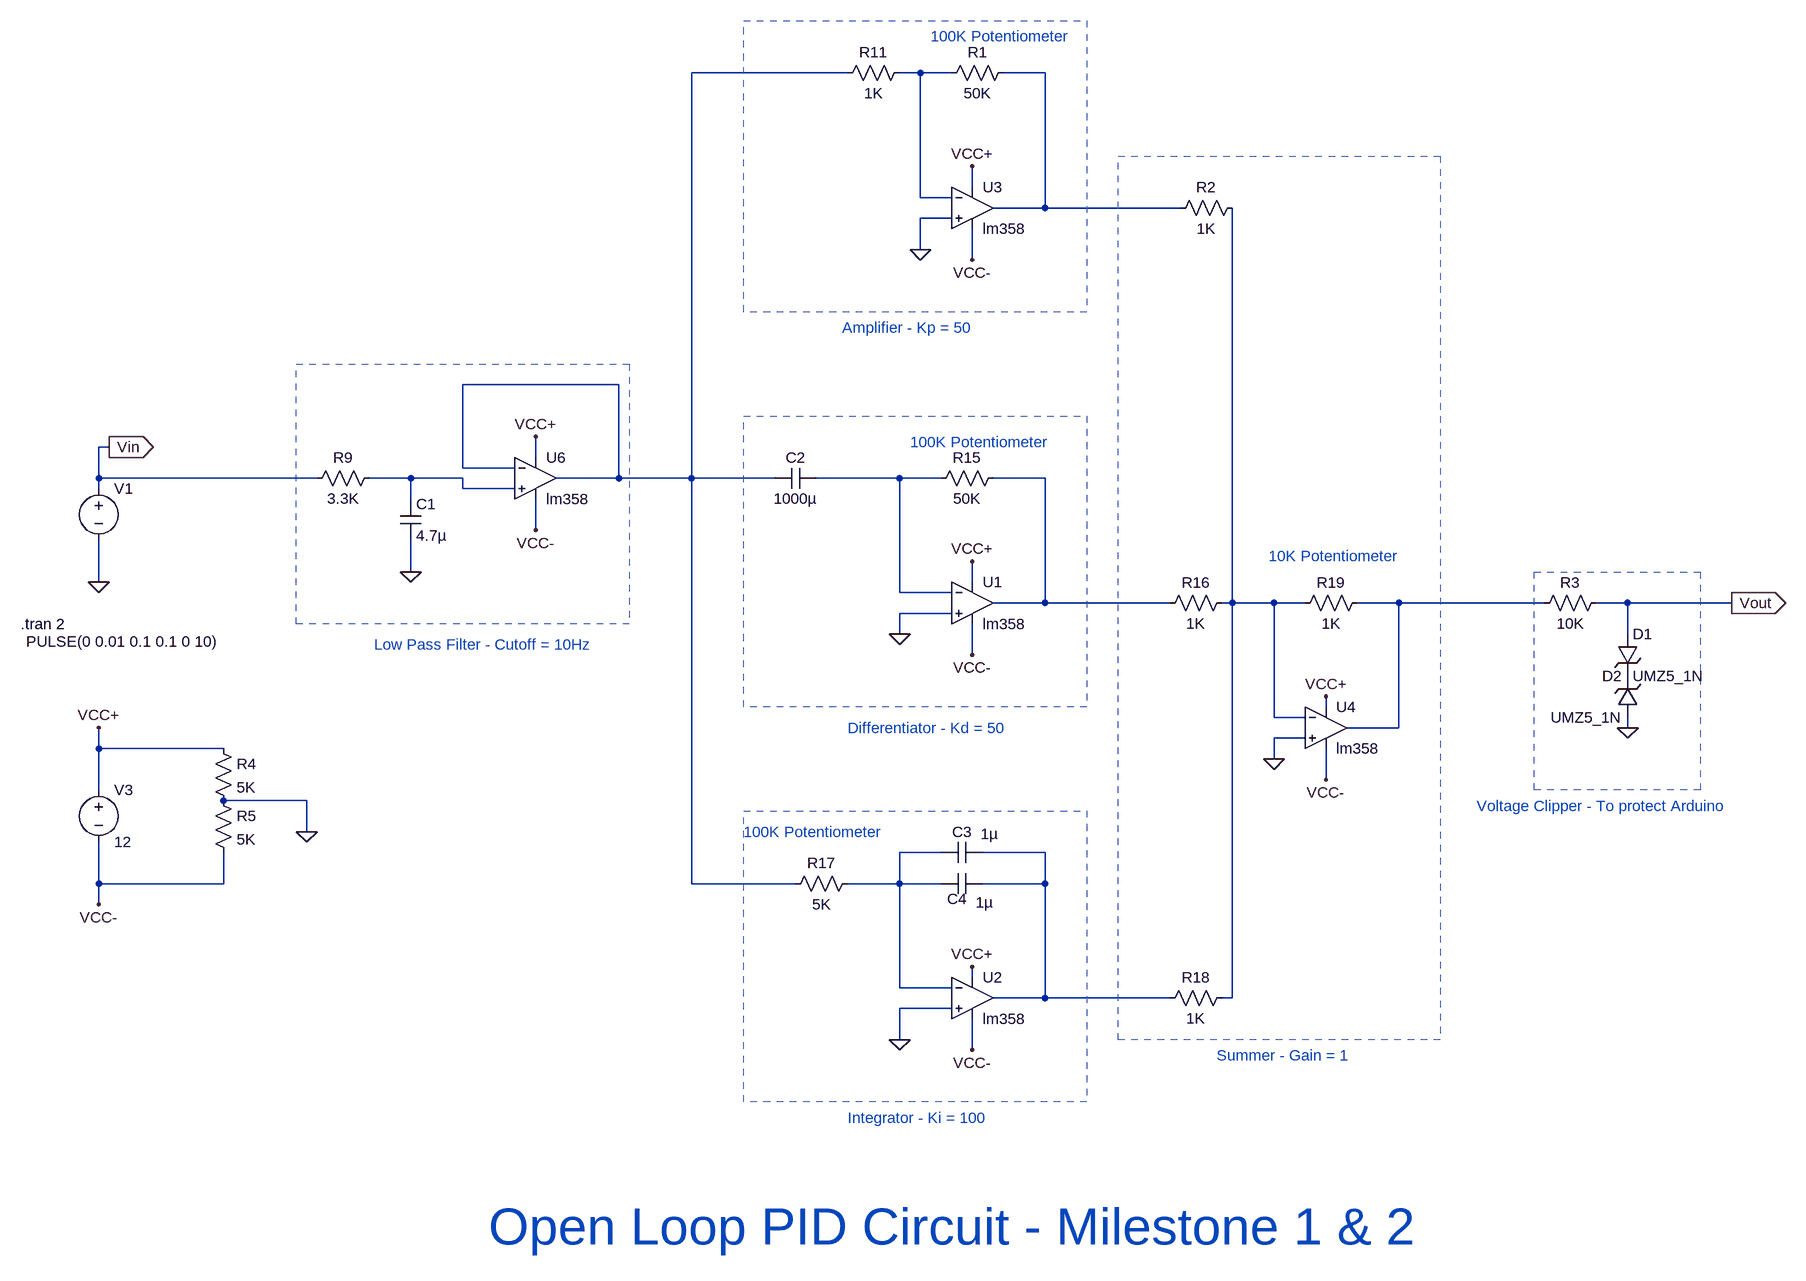
[diagram p0: schematic ElectronicsProject-PID-NoFeedback.asc]
ElectronicsProject-PID-NoFeedback.asc, the LTspice schematic file:
Version 4
SHEET 1 2816 1424
WIRE 1200 -400 960 -400
WIRE 1312 -400 1280 -400
WIRE 1360 -400 1312 -400
WIRE 1504 -400 1440 -400
WIRE 1392 -224 1392 -256
WIRE 1312 -208 1312 -400
WIRE 1360 -208 1312 -208
WIRE 1504 -192 1504 -400
WIRE 1504 -192 1424 -192
WIRE 1712 -192 1504 -192
WIRE 1360 -176 1312 -176
WIRE 1312 -128 1312 -176
WIRE 1392 -112 1392 -160
WIRE 848 80 608 80
WIRE 64 176 48 176
WIRE 720 192 720 160
WIRE 608 208 608 80
WIRE 688 208 608 208
WIRE 48 224 48 176
WIRE 384 224 48 224
WIRE 528 224 464 224
WIRE 608 224 528 224
WIRE 848 224 848 80
WIRE 848 224 752 224
WIRE 960 224 960 -400
WIRE 960 224 848 224
WIRE 1088 224 960 224
WIRE 1280 224 1152 224
WIRE 1344 224 1280 224
WIRE 1504 224 1424 224
WIRE 48 240 48 224
WIRE 608 240 608 224
WIRE 688 240 608 240
WIRE 528 256 528 224
WIRE 720 304 720 256
WIRE 528 368 528 320
WIRE 48 384 48 320
WIRE 1392 384 1392 352
WIRE 1280 400 1280 224
WIRE 1360 400 1280 400
WIRE 1504 416 1504 224
WIRE 1504 416 1424 416
WIRE 1696 416 1504 416
WIRE 1792 416 1792 -192
WIRE 1792 416 1776 416
WIRE 1856 416 1792 416
WIRE 1904 416 1856 416
WIRE 2048 416 1984 416
WIRE 2272 416 2048 416
WIRE 2400 416 2352 416
WIRE 2560 416 2400 416
WIRE 1360 432 1280 432
WIRE 1280 464 1280 432
WIRE 2400 464 2400 416
WIRE 1392 496 1392 448
WIRE 1936 576 1936 560
WIRE 1856 592 1856 416
WIRE 1904 592 1856 592
WIRE 2048 608 2048 416
WIRE 2048 608 1968 608
WIRE 2400 608 2400 592
WIRE 1904 624 1856 624
WIRE 48 640 48 608
WIRE 240 640 48 640
WIRE 1856 656 1856 624
WIRE 1936 688 1936 640
WIRE 48 704 48 640
WIRE 368 720 240 720
WIRE 368 768 368 720
WIRE 1344 800 1280 800
WIRE 1504 800 1408 800
WIRE 48 848 48 784
WIRE 240 848 240 800
WIRE 240 848 48 848
WIRE 960 848 960 224
WIRE 1120 848 960 848
WIRE 1280 848 1280 800
WIRE 1280 848 1200 848
WIRE 1344 848 1280 848
WIRE 1504 848 1504 800
WIRE 1504 848 1408 848
WIRE 48 880 48 848
WIRE 1392 992 1392 976
WIRE 1280 1008 1280 848
WIRE 1360 1008 1280 1008
WIRE 1504 1024 1504 848
WIRE 1504 1024 1424 1024
WIRE 1696 1024 1504 1024
WIRE 1792 1024 1792 416
WIRE 1792 1024 1776 1024
WIRE 1360 1040 1280 1040
WIRE 1280 1088 1280 1040
WIRE 1392 1104 1392 1056
FLAG 1392 352 VCC+
FLAG 1392 -256 VCC+
FLAG 1392 976 VCC+
FLAG 1936 560 VCC+
FLAG 1392 496 VCC-
FLAG 1392 1104 VCC-
FLAG 1936 688 VCC-
FLAG 1392 -112 VCC-
FLAG 2560 416 Vout
IOPIN 2560 416 Out
FLAG 64 176 Vin
IOPIN 64 176 Out
FLAG 48 384 0
FLAG 1312 -128 0
FLAG 1856 656 0
FLAG 1280 464 0
FLAG 1280 1088 0
FLAG 528 368 0
FLAG 2400 608 0
FLAG 368 768 0
FLAG 48 608 VCC+
FLAG 48 880 VCC-
FLAG 720 160 VCC+
FLAG 720 304 VCC-
SYMBOL res 1296 -416 R90
WINDOW 0 0 56 VBottom 2
WINDOW 3 32 56 VTop 2
SYMATTR InstName R11
SYMATTR Value 1K
SYMBOL res 1440 208 R90
WINDOW 0 0 56 VBottom 2
WINDOW 3 32 56 VTop 2
SYMATTR InstName R15
SYMATTR Value 50K
SYMATTR SpiceLine tol=1 pwr=0.1
SYMBOL res 1792 400 R90
WINDOW 0 0 56 VBottom 2
WINDOW 3 32 56 VTop 2
SYMATTR InstName R16
SYMATTR Value 1K
SYMBOL res 1216 832 R90
WINDOW 0 0 56 VBottom 2
WINDOW 3 32 56 VTop 2
SYMATTR InstName R17
SYMATTR Value 5K
SYMBOL cap 1408 832 R90
WINDOW 0 55 39 VBottom 2
WINDOW 3 29 -3 VTop 2
SYMATTR InstName C4
SYMATTR Value 1µ
SYMBOL res 1792 1008 R90
WINDOW 0 0 56 VBottom 2
WINDOW 3 32 56 VTop 2
SYMATTR InstName R18
SYMATTR Value 1K
SYMBOL res 2000 400 R90
WINDOW 0 0 56 VBottom 2
WINDOW 3 32 56 VTop 2
SYMATTR InstName R19
SYMATTR Value 1K
SYMBOL res 480 208 R90
WINDOW 0 0 56 VBottom 2
WINDOW 3 32 56 VTop 2
SYMATTR InstName R9
SYMATTR Value 3.3K
SYMATTR SpiceLine tol=1 pwr=0.1
SYMBOL voltage 48 224 R0
WINDOW 123 0 0 Left 0
WINDOW 39 0 0 Left 0
WINDOW 3 -112 251 Left 2
SYMATTR Value PULSE(0 0.01 0.1 0.1 0 10)
SYMATTR InstName V1
SYMBOL voltage 48 688 R0
WINDOW 123 0 0 Left 0
WINDOW 39 0 0 Left 0
SYMATTR InstName V3
SYMATTR Value 12
SYMBOL res 1456 -416 R90
WINDOW 0 0 56 VBottom 2
WINDOW 3 32 56 VTop 2
SYMATTR InstName R1
SYMATTR Value 50K
SYMBOL res 1808 -208 R90
WINDOW 0 0 56 VBottom 2
WINDOW 3 32 56 VTop 2
SYMATTR InstName R2
SYMATTR Value 1K
SYMBOL cap 512 256 R0
SYMATTR InstName C1
SYMATTR Value 4.7µ
SYMBOL cap 1152 208 R90
WINDOW 0 0 32 VBottom 2
WINDOW 3 32 32 VTop 2
SYMATTR InstName C2
SYMATTR Value 1000µ
SYMBOL zener 2384 464 R0
SYMATTR InstName D1
SYMATTR Value UMZ5_1N
SYMATTR Description Diode
SYMATTR Type diode
SYMBOL zener 2416 592 R180
WINDOW 0 24 64 Left 2
WINDOW 3 24 0 Left 2
SYMATTR InstName D2
SYMATTR Value UMZ5_1N
SYMATTR Description Diode
SYMATTR Type diode
SYMBOL res 2368 400 R90
WINDOW 0 0 56 VBottom 2
WINDOW 3 32 56 VTop 2
SYMATTR InstName R3
SYMATTR Value 10K
SYMBOL cap 1408 784 R90
WINDOW 0 0 32 VBottom 2
WINDOW 3 -28 -10 VTop 2
SYMATTR InstName C3
SYMATTR Value 1µ
SYMBOL res 224 624 R0
SYMATTR InstName R4
SYMATTR Value 5K
SYMBOL res 224 704 R0
SYMATTR InstName R5
SYMATTR Value 5K
SYMBOL OpAmps\\lm358 720 160 R0
SYMATTR InstName U6
SYMBOL OpAmps\\lm358 1392 352 R0
SYMATTR InstName U1
SYMBOL OpAmps\\lm358 1392 960 R0
SYMATTR InstName U2
SYMBOL OpAmps\\lm358 1392 -256 R0
SYMATTR InstName U3
SYMBOL OpAmps\\lm358 1936 544 R0
SYMATTR InstName U4
TEXT -72 448 Left 2 !.tran 2
TEXT 1328 -456 Left 2 ;100K Potentiometer
TEXT 1296 168 Left 2 ;100K Potentiometer
TEXT 1040 768 Left 2 ;100K Potentiometer
TEXT 648 1376 Left 6 ;Open Loop PID Circuit - Milestone 1 & 2
TEXT 1848 344 Left 2 ;10K Potentiometer
TEXT 2168 728 Left 2 ;Voltage Clipper - To protect Arduino
TEXT 1768 1112 Left 2 ;Summer - Gain = 1
TEXT 1200 1208 Left 2 ;Integrator - Ki = 100
TEXT 1200 608 Left 2 ;Differentiator - Kd = 50
TEXT 1192 -8 Left 2 ;Amplifier - Kp = 50
TEXT 472 480 Left 2 ;Low Pass Filter - Cutoff = 10Hz
RECTANGLE Normal 2512 704 2256 368 2
RECTANGLE Normal 2112 1088 1616 -272 2
RECTANGLE Normal 1568 1184 1040 736 2
RECTANGLE Normal 1568 576 1040 128 2
RECTANGLE Normal 1568 -32 1040 -480 2
RECTANGLE Normal 864 448 352 48 2

The netlist it stands for:
* ElectronicsProject-PID-NoFeedback.asc
R11 N002 N001 1K
R15 N006 N005 50K tol=1 pwr=0.1
R16 N007 N006 1K
R17 N009 N001 5K
C4 N010 N009 1µ
R18 N007 N010 1K
R19 N008 N007 1K
R9 N004 Vin 3.3K tol=1 pwr=0.1
V1 Vin 0 PULSE(0 0.01 0.1 0.1 0 10)
V3 VCC+ VCC- 12
R1 N003 N002 50K
R2 N007 N003 1K
C1 N004 0 4.7µ
C2 N005 N001 1000µ
D1 Vout P001 UMZ5_1N
D2 0 P001 UMZ5_1N
R3 Vout N008 10K
C3 N010 N009 1µ
R4 VCC+ 0 5K
R5 0 VCC- 5K
XU6 N004 N001 VCC+ VCC- N001 lm358  ; pins In+ In- V+ V- OUT
XU1 0 N005 VCC+ VCC- N006 lm358  ; pins In+ In- V+ V- OUT
XU2 0 N009 VCC+ VCC- N010 lm358  ; pins In+ In- V+ V- OUT
XU3 0 N002 VCC+ VCC- N003 lm358  ; pins In+ In- V+ V- OUT
XU4 0 N007 VCC+ VCC- N008 lm358  ; pins In+ In- V+ V- OUT
.model D D
.lib standard.dio
.tran 2
* 100K Potentiometer
* 100K Potentiometer
* 100K Potentiometer
* Open Loop PID Circuit - Milestone 1 & 2
* 10K Potentiometer
* Voltage Clipper - To protect Arduino
* Summer - Gain = 1
* Integrator - Ki = 100
* Differentiator - Kd = 50
* Amplifier - Kp = 50
* Low Pass Filter - Cutoff = 10Hz
.backanno
.end